# Altium schematic sheet RDA5981C.SchDoc
size A3
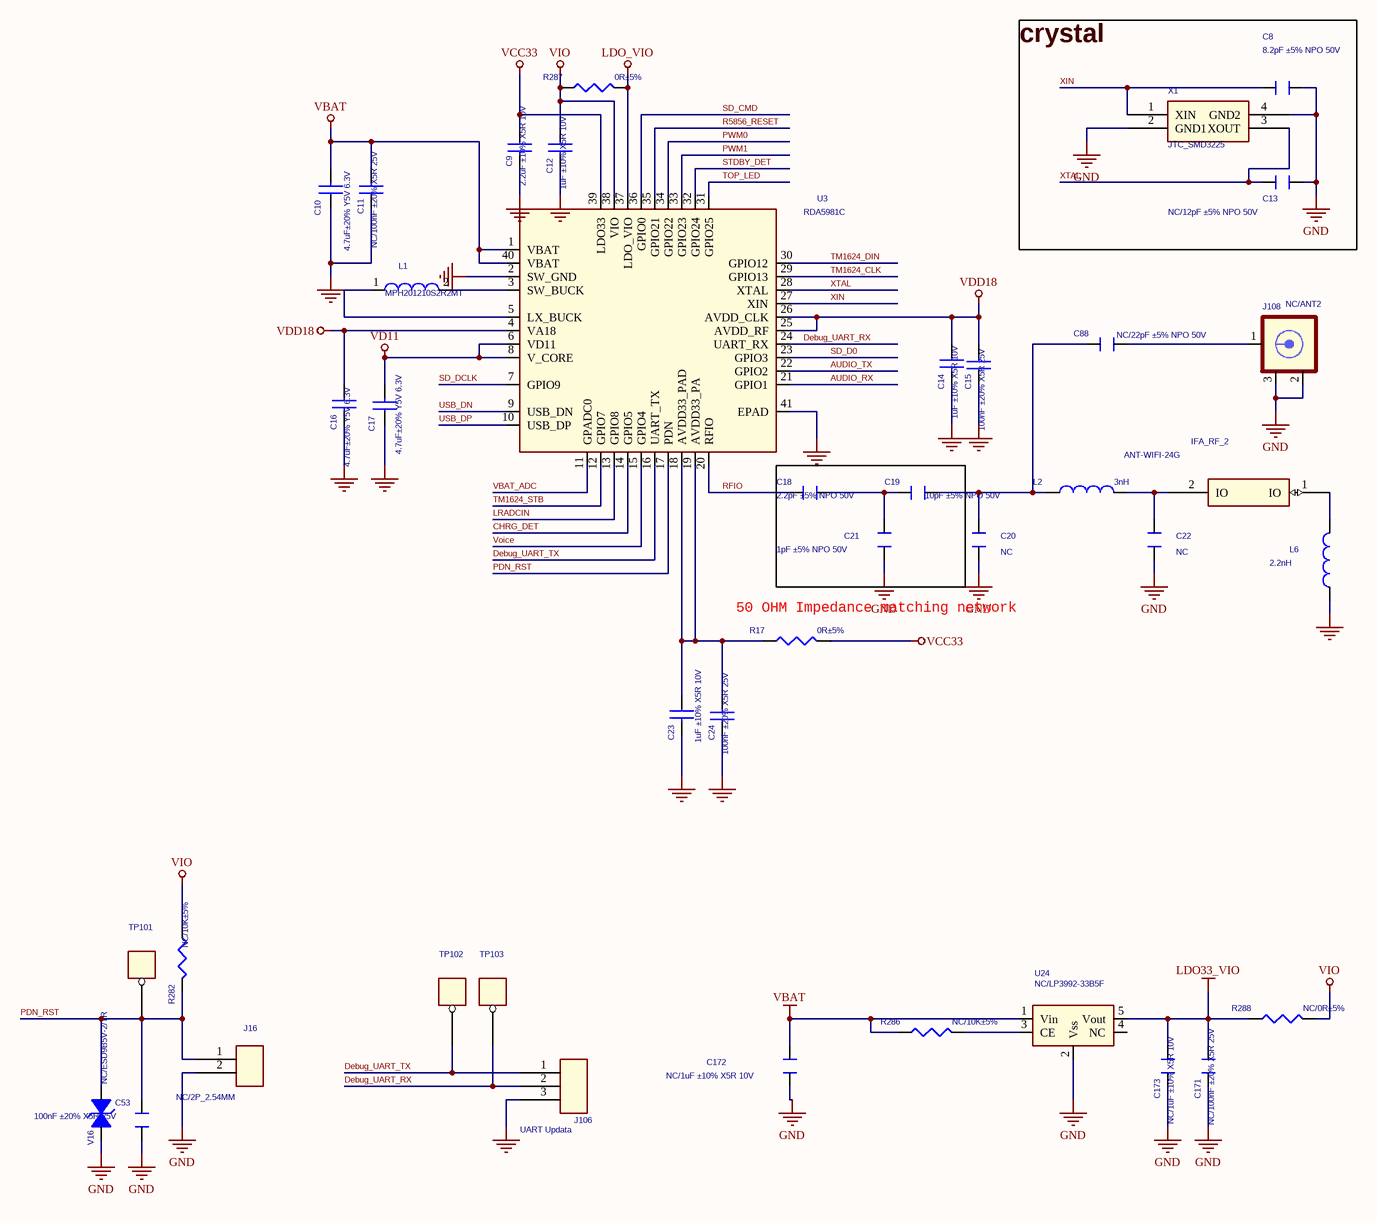
[diagram p0: RDA5981C.SchDoc]

## Parts
C8  8.2pF ±5% NPO 50V  [C0402]
C9  2.2uF ±10% X5R 10V  [C0402]
C10  4.7uF±20% Y5V 6.3V  [C0402]
C11  NC/100nF ±20% X5R 25V  [C0402]
C12  1uF ±10% X5R 10V  [C0402]
C13  NC/12pF ±5% NPO 50V  [C0402]
C14  1uF ±10% X5R 10V  [C0402]
C15  100nF ±20% X5R 25V  [C0402]
C16  4.7uF±20% Y5V 6.3V  [C0402]
C17  4.7uF±20% Y5V 6.3V  [C0402]
C18  2.2pF ±5% NPO 50V  [C0402]
C19  10pF ±5% NPO 50V  [C0402]
C20  NC  [C0402]
C21  1pF ±5% NPO 50V  [C0402]
C22  NC  [C0402]
C23  1uF ±10% X5R 10V  [C0402]
C24  100nF ±20% X5R 25V  [C0402]
C53  100nF ±20% X5R 25V  [C0402]
C88  NC/22pF ±5% NPO 50V  [C0402]
C171  NC/100nF ±20% X5R 25V  [C0402]
C172  NC/1uF ±10% X5R 10V  [C0402]
C173  NC/1uF ±10% X5R 10V  [C0402]
IFA_RF_2  ANT-WIFI-24G  [IFA_RF_1]
J16  NC/2P_2.54MM  [SIP100-2P]
J106  UART Updata  [SIP100-3P]
J108  NC/ANT2  [ANT]
L1  MPH201210S2R2MT  [L0805]
L2  3nH  [L0402]
L6  2.2nH  [L0402]
R17  0R±5%  [R0402]
R282  NC/10K±5%  [R0402]
R286  NC/10K±5%  [R0402]
R287  0R±5%  [R0402]
R288  NC/0R±5%  [R0402]
TP101  TP25RD  [TPC]  (value not drawn)
TP102  TP25RD  [TPC]  (value not drawn)
TP103  TP25RD  [TPC]  (value not drawn)
U3  RDA5981C  [QFN40-5X5-T1.0-RDA5981C]
U24  NC/LP3992-33B5F  [SOT23-6]
V16  NC/ESD9B5V-2/TR  [ESD0402]
X1  JTC_SMD3225  [SMD_3225]

## Blocks framed on the sheet
crystal: C8 C13 X1

## Nets
GND: C8.1 C9.2 C10.1 C11.1 C12.2 C13.1 C14.2 C15.1 C16.2 C17.1 C20.2 C21.2 C22.2 C23.2 C24.1 C53.1 C171.1 C172.1 C173.1 J16.2 J106.3 J108.2(SHIELD1) J108.3(SHIELD2) L6.1 U3.2(SW_GND) U3.41(EPAD) U24.2(Vss) V16.2(I/O2) X1.2(GND1) X1.4(GND2)
LDO33_VIO: C171.2 C173.2 R288.1 U24.5(Vout)
LDO_VIO: R287.2 U3.37(LDO_VIO)
VBAT: C10.2 C11.2 C172.2 R286.1 U3.1(VBAT) U3.40(VBAT) U24.1(Vin)
VCC33: C9.1 R17.2 U3.39(LDO33)
VD11: C17.2 U3.6(VD11) U3.8(V_CORE)
VDD18: C14.1 C15.2 C16.1 U3.4(VA18) U3.25(AVDD_RF) U3.26(AVDD_CLK)
VIO: C12.1 R282.1 R287.1 R288.2 U3.38(VIO)
AUDIO_RX: U3.21(GPIO1)
AUDIO_TX: U3.22(GPIO2)
CHRG_DET: U3.14(GPIO5)
Debug_UART_RX: J106.2 TP103.1(TP1) U3.24(UART_RX)
Debug_UART_TX: J106.1 TP102.1(TP1) U3.16(UART_TX)
LRADCIN: U3.13(GPIO8)
PDN_RST: C53.2 J16.1 R282.2 TP101.1(TP1) U3.17(PDN) V16.1(I/O1)
PWM0: U3.34(GPIO22)
PWM1: U3.33(GPIO23)
R5856_RESET: U3.35(GPIO21)
RFIO: C18.2 U3.20(RFIO)
SD_CMD: U3.36(GPIO0)
SD_D0: U3.23(GPIO3)
SD_DCLK: U3.7(GPIO9)
STDBY_DET: U3.32(GPIO24)
TM1624_CLK: U3.29(GPIO13)
TM1624_DIN: U3.30(GPIO12)
TM1624_STB: U3.12(GPIO7)
TOP_LED: U3.31(GPIO25)
USB_DN: U3.9(USB_DN)
USB_DP: U3.10(USB_DP)
VBAT_ADC: U3.11(GPADC0)
Voice: U3.15(GPIO4)
XIN: C8.2 U3.27(XIN) X1.1(XIN)
XTAL: C13.2 U3.28(XTAL) X1.3(XOUT)
NetC18_1: C18.1 C19.2 C21.1
NetC19_1: C19.1 C20.1 C88.2 L2.1
NetC22_1: C22.1 IFA_RF_2.2(IO) L2.2
NetC23_1: C23.1 C24.2 R17.1 U3.18(AVDD33_PAD) U3.19(AVDD33_PA)
NetC88_1: C88.1 J108.1(CENTER)
NetIFA_RF_2_1: IFA_RF_2.1(IO) L6.2
NetL1_1: L1.1 U3.5(LX_BUCK)
NetL1_2: L1.2 U3.3(SW_BUCK)
NetR286_2: R286.2 U24.3(CE)

Not connected (* = marked no-connect by the designer): U24 4(NC)

## Notes on the sheet
- (near R17) 50 OHM Impedance matching network

## Library data of the parts
C8 C13 C20-C22 C53 = CAPACITOR_0_Dup4: PAGE: 2
C9 C12 C14 C16 C23 = CAP NP_Dup6
C10 C17 = CAP NP_Dup4: Assembly: C0603
C11 C15 C24 = CAP NP_Dup5
C18 C19 C88 = CAPACITOR_Dup2
C171-C173 = CAPACITOR_Dup2: PAGE: 1
IFA_RF_2 = ANT-25G-R-CB_0
J16 = CON4_1
J106 = CON3
J108 = SMA/RF_0
L1 = INDUCTOR: RoHS Power Inductor 22uH 300mA H<1.8MM,CD32
L2 L6 = INDUCTOR_Dup1: PART_TYPE: L42; PART_NUMBER: L42-0201S3N320ACX0
R17 R282 = R_Dup2: ROOM: TFCARD&USB&KEY
R286-R288 = R_Dup3
TP101 TP102 = TEST_POINT: PAD_SM;TEST;0.025 ROUND; Part Number: G500-0000506; Type Package: SM PAD; BOM Notes: DNE; Compliance: NoData; Part Type: TEST POINT; Lifecycle: Full Production
TP103 = TEST_POINT: PAD_SM;TEST;0.025 ROUND; Part Number: G500-0000506; Compliance: NoData; BOM Notes: DNE; Type Package: SM PAD; Lifecycle: Full Production; Part Type: TEST POINT
U3 = RDA5981C_0
U24 = RT9266PE_12
V16 = Varistor: Mutilayer Varistor,,5.5V,10PF; Manufacturer: Inpaq; Part_Number: EB3.100NV05402A; Part_Name: Varistor
X1 = CRYSTAL-4_0: Crystal 24MHz 20pF 10ppm  -30 to +85; PART NUMBER: 7M24000004; Vendor: TXC; SPREADWIN PN: U3000019A